# Altium project 2019主控板v1.2.PrjPcb
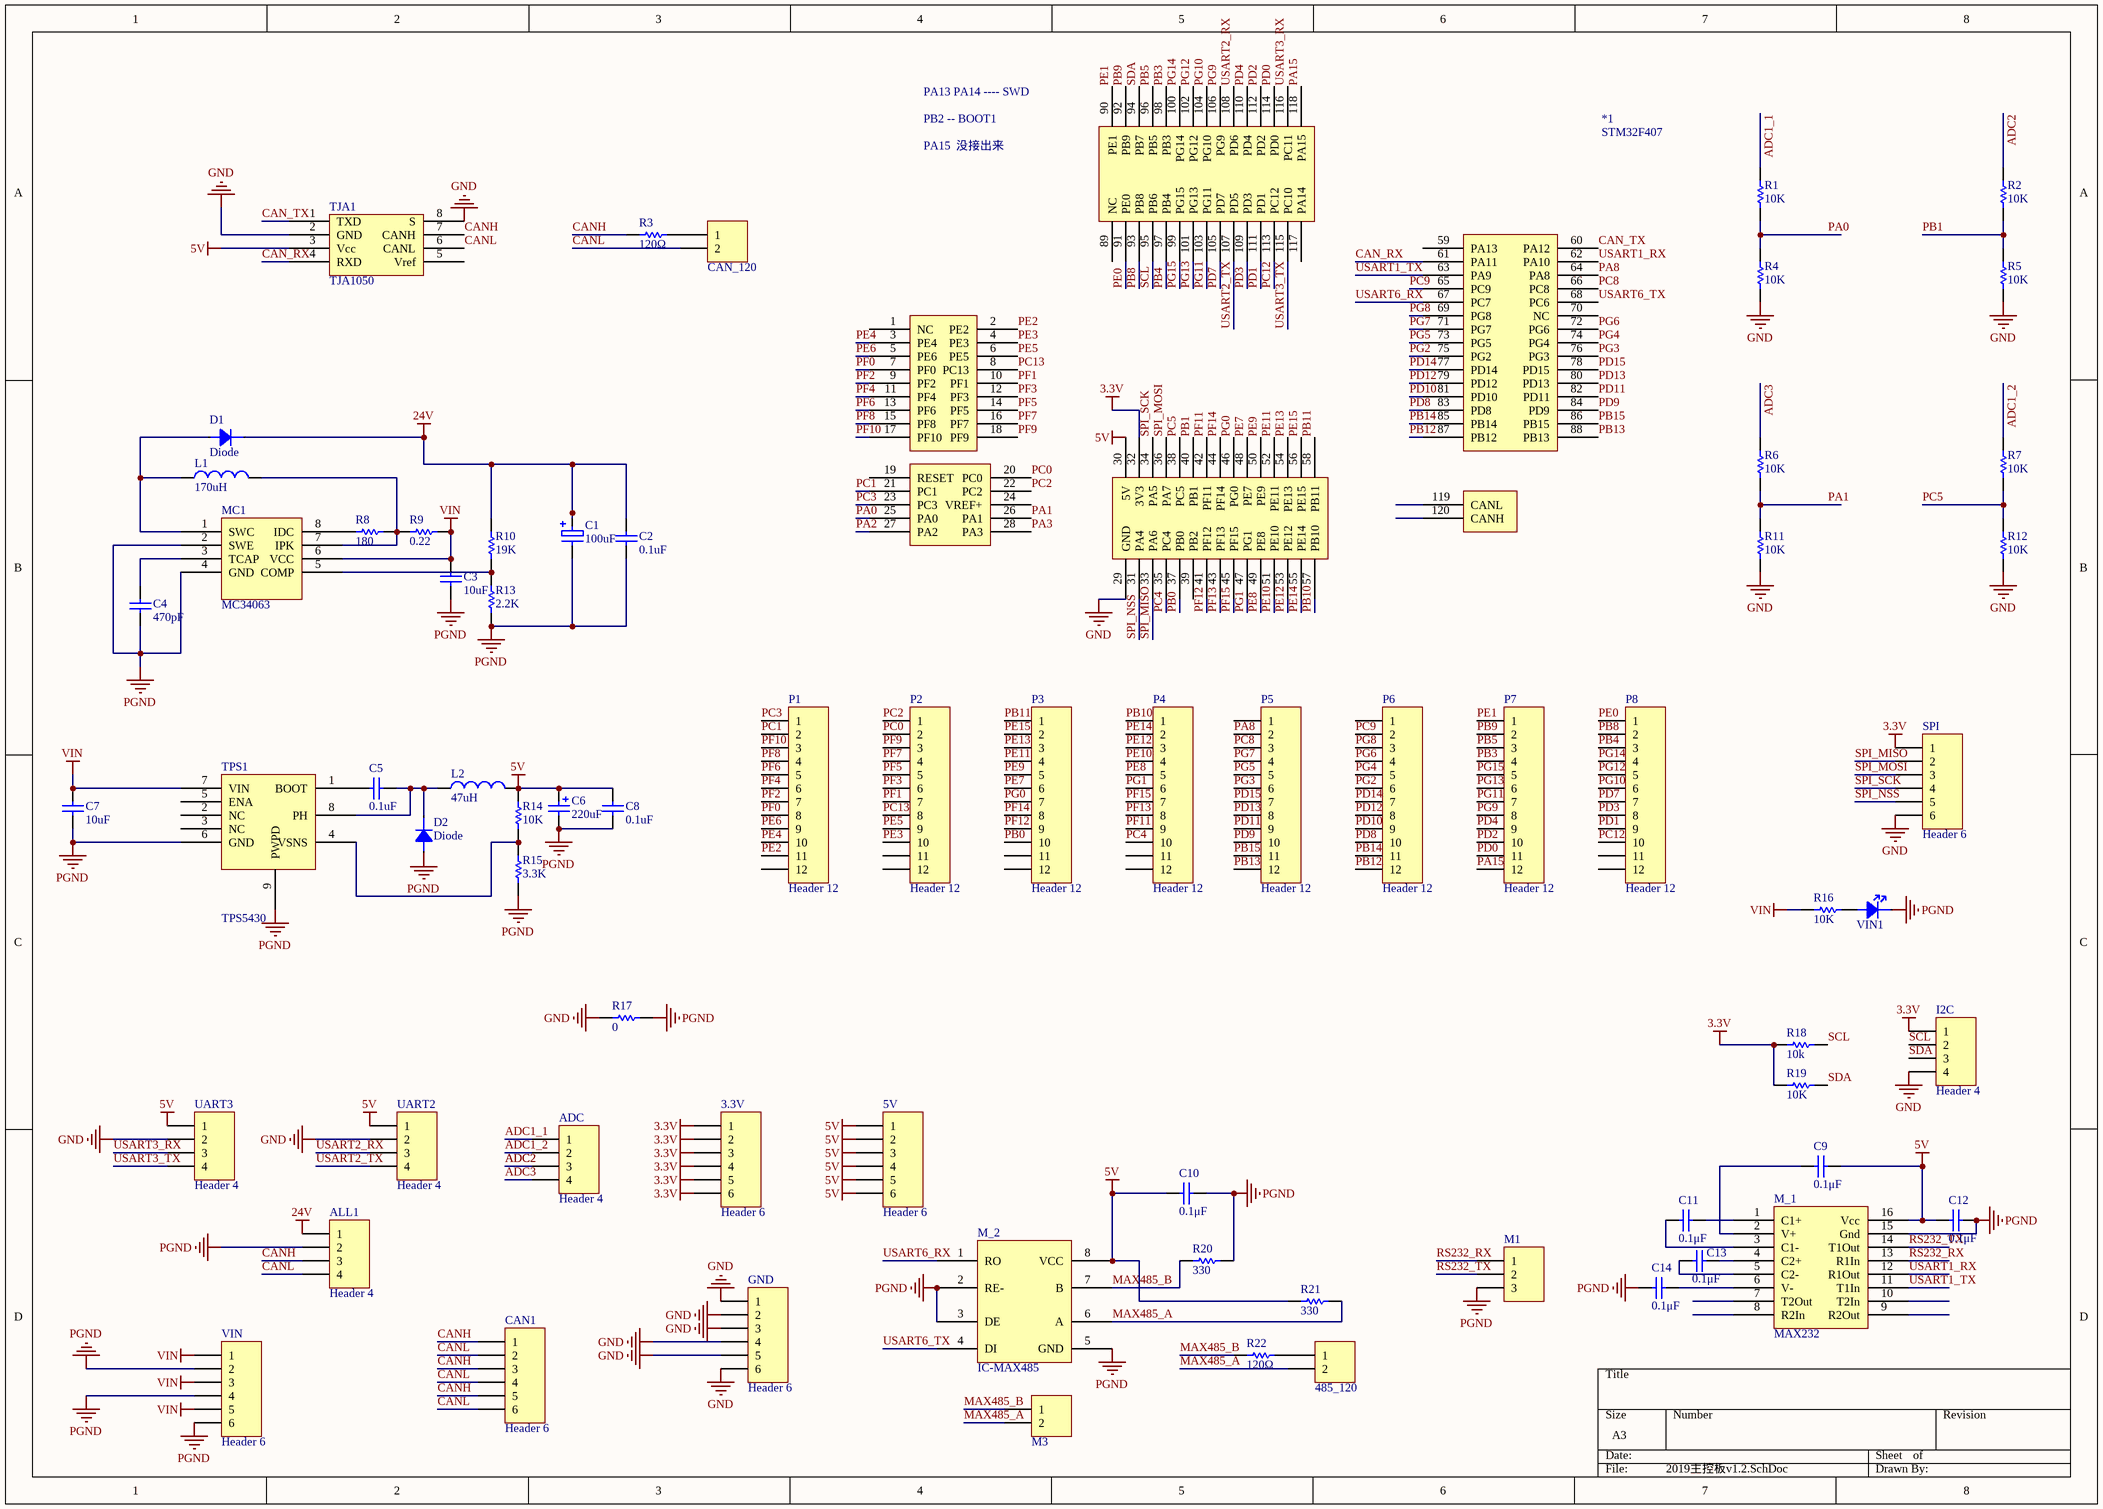
[diagram p0: 2019主控板v1.2.SchDoc]
1 sheet, 70 parts. Net scope: global (net labels, ports and power ports of the same name join across sheets).
Board file: 2019主控板v1.2.PcbDoc

## Sheet 2019主控板v1.2.SchDoc
size A3

### Parts
3.3V  Header 6  [XH-2.54PIN6]
5V  Header 6  [XH-2.54PIN6]
485_120  Header 2  [SIP2]  (value not drawn)
*1  STM32F407  [STM32F407]
ADC  Header 4  [XH-2.54pin4]
ALL1  Header 4  [XH-2.54pin4]
C1  100uF  [C_ELE]
C2  value 0.1uF  [CAP-MLCC-0603]  (hidden comment: Cap)
C3  value 10uF  [0805C]  (hidden comment: Cap)
C4  value 470pF  [CAP-MLCC-0603]  (hidden comment: Cap)
C5  value 0.1uF  [CAP-MLCC-0603]  (hidden comment: Cap)
C6  value 220uF  [CAP-TAN-7343/CAPD]  (hidden comment: Cap Pol1)
C7  value 10uF  [0805C]  (hidden comment: Cap)
C8  value 0.1uF  [CAP-MLCC-0603]  (hidden comment: Cap)
C9  0.1μF  [CAP-MLCC-0603]
C10  0.1μF  [CAP-MLCC-0603]
C11  0.1μF  [CAP-MLCC-0603]
C12  0.1μF  [CAP-MLCC-0603]
C13  0.1μF  [CAP-MLCC-0603]
C14  0.1μF  [CAP-MLCC-0603]
CAN1  Header 6  [Green_6P]
CAN_120  Header 2  [SIP2]  (value not drawn)
D1  Diode  [SS34]
D2  Diode  [SS34]
GND  Header 6  [XH-2.54PIN6]
I2C  Header 4  [XH-2.54pin4]
L1  value 170uH  [CD74]  (hidden comment: Inductor)
L2  value 47uH  [CD74]  (hidden comment: Inductor)
M1  Header 3  [Green_3P]  (value not drawn)
M3  Header 2  [Green_2P]  (value not drawn)
M_1  MAX232  [SO-16_M]
M_2  IC-MAX485  [SO8_M]
MC1  MC34063  [SO8]
P1  Header 12  [XH-2.54PIN12]
P2  Header 12  [XH-2.54PIN12]
P3  Header 12  [XH-2.54PIN12]
P4  Header 12  [XH-2.54PIN12]
P5  Header 12  [XH-2.54PIN12]
P6  Header 12  [XH-2.54PIN12]
P7  Header 12  [XH-2.54PIN12]
P8  Header 12  [XH-2.54PIN12]
R1  value 10K  [RES-0603]  (hidden comment: Res1)
R2  value 10K  [RES-0603]  (hidden comment: Res1)
R3  120Ω  [RES-0603]
R4  value 10K  [RES-0603]  (hidden comment: Res1)
R5  value 10K  [RES-0603]  (hidden comment: Res1)
R6  value 10K  [RES-0603]  (hidden comment: Res1)
R7  value 10K  [RES-0603]  (hidden comment: Res1)
R8  value 180  [RES-0603]  (hidden comment: Res1)
R9  value 0.22  [RES-0603]  (hidden comment: Res1)
R10  value 19K  [RES-0603]  (hidden comment: Res1)
R11  value 10K  [RES-0603]  (hidden comment: Res1)
R12  value 10K  [RES-0603]  (hidden comment: Res1)
R13  value 2.2K  [RES-0603]  (hidden comment: Res1)
R14  value 10K  [RES-0603]  (hidden comment: Res1)
R15  value 3.3K  [RES-0603]  (hidden comment: Res1)
R16  value 10K  [RES-0603]  (hidden comment: Res1)
R17  value 0  [RES-0603]  (hidden comment: Res1)
R18  10k  [RES-0603]
R19  10K  [RES-0603]
R20  330  [RES-0603]
R21  330  [RES-0603]
R22  120Ω  [RES-0603]
SPI  Header 6  [XH-2.54PIN6]
TJA1  TJA1050  [TJA1050]
TPS1  TPS5430  [TPS5430]
UART2  Header 4  [HDR1X4]
UART3  Header 4  [HDR1X4]
VIN  Header 6  [Green_6P]
VIN1  lED  [0805D]  (value not drawn)

### Nets
3.3V: 3.3V.1 3.3V.2 3.3V.3 3.3V.4 3.3V.5 3.3V.6 *1.32(3V3) I2C.1 R18.1 R19.1 SPI.1
5V: 5V.1 5V.2 5V.3 5V.4 5V.5 5V.6 *1.30(5V) C6.1 C8.2 C9.2 C10.1 C12.1 L2.2 M_1.16(Vcc) M_2.8(VCC) R14.2 R21.2 TJA1.3(Vcc) UART2.1 UART3.1
24V: ALL1.1 C1.1 C2.2 D1.K R10.1
GND: *1.29(GND) GND.1 GND.2 GND.3 GND.4 GND.5 GND.6 I2C.4 R4.1 R5.1 R11.1 R12.1 R17.2 SPI.6 TJA1.2(GND) TJA1.8(S) UART2.2 UART3.2
PGND: ALL1.2 C1.2 C2.1 C3.1 C4.1 C6.2 C7.1 C8.1 C10.2 C12.2 C14.1 D2.A M1.3 M_1.15(Gnd) M_2.2(RE-) M_2.3(DE) M_2.5(GND) MC1.2(SWE) MC1.4(GND) R13.2 R15.1 R17.1 R20.1 TPS1.6(GND) TPS1.9(PWPD) VIN.2 VIN.4 VIN.6 VIN1.K
VIN: C3.2 C7.2 MC1.6(VCC) R9.1 R16.2 TPS1.7(VIN) VIN.1 VIN.3 VIN.5
ADC1_1: ADC.1 R1.2
ADC1_2: ADC.2 R7.2
ADC2: ADC.3 R2.2
ADC3: ADC.4 R6.2
CAN_RX: *1.61(PA11) TJA1.4(RXD)
CAN_TX: *1.60(PA12) TJA1.1(TXD)
CANH: ALL1.3 CAN1.1 CAN1.3 CAN1.5 R3.2 TJA1.7(CANH)
CANL: ALL1.4 CAN1.2 CAN1.4 CAN1.6 CAN_120.2 TJA1.6(CANL)
MAX485_A: 485_120.2 M3.2 M_2.6(A) R21.1
MAX485_B: M3.1 M_2.7(B) R20.2 R22.2
PA0: *1.25(PA0) R1.1 R4.2
PA1: *1.26(PA1) R6.1 R11.2
PA2: *1.27(PA2)
PA3: *1.28(PA3)
PA8: *1.64(PA8) P5.2
PA15: *1.118(PA15) P7.12
PB0: *1.37(PB0) P3.10
PB1: *1.40(PB1) R2.1 R5.2
PB3: *1.98(PB3) P7.4
PB4: *1.97(PB4) P8.3
PB5: *1.96(PB5) P7.3
PB8: *1.93(PB8) P8.2
PB9: *1.92(PB9) P7.2
PB10: *1.57(PB10) P4.1
PB11: *1.58(PB11) P3.1
PB12: *1.87(PB12) P6.12
PB13: *1.88(PB13) P5.12
PB14: *1.85(PB14) P6.11
PB15: *1.86(PB15) P5.11
PC0: *1.20(PC0) P2.2
PC1: *1.21(PC1) P1.2
PC2: *1.22(PC2) P2.1
PC3: *1.23(PC3) P1.1
PC4: *1.35(PC4) P4.10
PC5: *1.38(PC5) R7.1 R12.2
PC8: *1.66(PC8) P5.3
PC9: *1.65(PC9) P6.2
PC12: *1.113(PC12) P8.10
PC13: *1.8(PC13) P2.8
PD0: *1.114(PD0) P7.11
PD1: *1.111(PD1) P8.9
PD2: *1.112(PD2) P7.10
PD3: *1.109(PD3) P8.8
PD4: *1.110(PD4) P7.9
PD7: *1.105(PD7) P8.7
PD8: *1.83(PD8) P6.10
PD9: *1.84(PD9) P5.10
PD10: *1.81(PD10) P6.9
PD11: *1.82(PD11) P5.9
PD12: *1.79(PD12) P6.8
PD13: *1.80(PD13) P5.8
PD14: *1.77(PD14) P6.7
PD15: *1.78(PD15) P5.7
PE0: *1.91(PE0) P8.1
PE1: *1.90(PE1) P7.1
PE2: *1.2(PE2) P1.11
PE3: *1.4(PE3) P2.10
PE4: *1.3(PE4) P1.10
PE5: *1.6(PE5) P2.9
PE6: *1.5(PE6) P1.9
PE7: *1.48(PE7) P3.6
PE8: *1.49(PE8) P4.5
PE9: *1.50(PE9) P3.5
PE10: *1.51(PE10) P4.4
PE11: *1.52(PE11) P3.4
PE12: *1.53(PE12) P4.3
PE13: *1.54(PE13) P3.3
PE14: *1.55(PE14) P4.2
PE15: *1.56(PE15) P3.2
PF0: *1.7(PF0) P1.8
PF1: *1.10(PF1) P2.7
PF2: *1.9(PF2) P1.7
PF3: *1.12(PF3) P2.6
PF4: *1.11(PF4) P1.6
PF5: *1.14(PF5) P2.5
PF6: *1.13(PF6) P1.5
PF7: *1.16(PF7) P2.4
PF8: *1.15(PF8) P1.4
PF9: *1.18(PF9) P2.3
PF10: *1.17(PF10) P1.3
PF11: *1.42(PF11) P4.9
PF12: *1.41(PF12) P3.9
PF13: *1.43(PF13) P4.8
PF14: *1.44(PF14) P3.8
PF15: *1.45(PF15) P4.7
PG0: *1.46(PG0) P3.7
PG1: *1.47(PG1) P4.6
PG2: *1.75(PG2) P6.6
PG3: *1.76(PG3) P5.6
PG4: *1.74(PG4) P6.5
PG5: *1.73(PG5) P5.5
PG6: *1.72(PG6) P6.4
PG7: *1.71(PG7) P5.4
PG8: *1.69(PG8) P6.3
PG9: *1.106(PG9) P7.8
PG10: *1.104(PG10) P8.6
PG11: *1.103(PG11) P7.7
PG12: *1.102(PG12) P8.5
PG13: *1.101(PG13) P7.6
PG14: *1.100(PG14) P8.4
PG15: *1.99(PG15) P7.5
RS232_RX: M1.1 M_1.13(R1In)
RS232_TX: M1.2 M_1.14(T1Out)
SCL: *1.95(PB6) I2C.2 R18.2
SDA: *1.94(PB7) I2C.3 R19.2
SPI_MISO: *1.33(PA6) SPI.2
SPI_MOSI: *1.36(PA7) SPI.3
SPI_NSS: *1.31(PA4) SPI.5
SPI_SCK: *1.34(PA5) SPI.4
USART1_RX: *1.62(PA10) M_1.12(R1Out)
USART1_TX: *1.63(PA9) M_1.11(T1In)
USART2_RX: *1.108(PD6) UART2.3
USART2_TX: *1.107(PD5) UART2.4
USART3_RX: *1.116(PC11) UART3.3
USART3_TX: *1.115(PC10) UART3.4
USART6_RX: *1.67(PC7) M_2.1(RO)
USART6_TX: *1.68(PC6) M_2.4(DI)
Net485_120_1: 485_120.1 R22.1
NetC4_2: C4.2 MC1.3(TCAP)
NetC5_1: C5.1 TPS1.1(BOOT)
NetC5_2: C5.2 D2.K L2.1 TPS1.8(PH)
NetC9_1: C9.1 M_1.2(V+)
NetC11_1: C11.1 M_1.3(C1-)
NetC11_2: C11.2 M_1.1(C1+)
NetC13_1: C13.1 M_1.5(C2-)
NetC13_2: C13.2 M_1.4(C2+)
NetC14_2: C14.2 M_1.6(V-)
NetCAN_120_1: CAN_120.1 R3.1
NetD1_A: D1.A L1.1 MC1.1(SWC)
NetL1_2: L1.2 MC1.7(IPK) R8.1 R9.2
NetMC1_5: MC1.5(COMP) R10.2 R13.1
NetMC1_8: MC1.8(IDC) R8.2
NetR14_1: R14.1 R15.2 TPS1.4(VSNS)
NetR16_1: R16.1 VIN1.A

Not connected (* = marked no-connect by the designer): *1 1(NC) 19(RESET) 24(VREF+) 39(PB2) 59(PA13) 70(NC) 89(NC) 117(PA14) 119(CANL) 120(CANH); M_1 7(T2Out) 8(R2In) 9(R2Out) 10(T2In); P1 12; P2 11 12; P3 11 12; P4 11 12; P5 1; P6 1; P8 11 12; TJA1 5(Vref); TPS1 2(NC) 3(NC) 5(ENA)

### Notes on the sheet
- (near *1) PA13 PA14 ---- SWD
- (near *1) PB2 -- BOOT1
- (near *1) PA15  没接出来

### Library data of the parts
3.3V 5V CAN1 GND SPI VIN = Header 6: Header, 6-Pin; LatestRevisionDate: 17-Jul-2002; LatestRevisionNote: Re-released for DXP Platform.; Publisher: Altium Limited
485_120 CAN_120 M3 = Header 2: Header, 2-Pin; LatestRevisionDate: 17-Jul-2002; LatestRevisionNote: Re-released for DXP Platform.; Publisher: Altium Limited
ADC ALL1 I2C UART2 UART3 = Header 4: Header, 4-Pin; LatestRevisionDate: 17-Jul-2002; LatestRevisionNote: Re-released for DXP Platform.; Publisher: Altium Limited
C1 = CAP-ELE: 电解电容; Value: *μF; Published: 8-Jun-2000; LatestRevisionDate: 17-Jul-2002; LatestRevisionNote: Re-released for DXP Platform.; PackageReference: RB7.6-15; Publisher: Altium Limited; PackageDescription: Polarized Capacitor (Radial); 2 Leads
C2-C5 C7 C8 = Cap: Capacitor; Published: 8-Jun-2000; LatestRevisionDate: 17-Jul-2002; LatestRevisionNote: Re-released for DXP Platform.; PackageReference: RAD-0.3; Publisher: Altium Limited
C6 = Cap Pol1: Polarized Capacitor (Radial); Published: 8-Jun-2000; LatestRevisionDate: 17-Jul-2002; LatestRevisionNote: Re-released for DXP Platform.; PackageReference: RB7.6-15; Publisher: Altium Limited
C9-C14 = CAP: 无极性电容; Value: *μF; Published: 8-Jun-2000; LatestRevisionDate: 17-Jul-2002; LatestRevisionNote: Re-released for DXP Platform.; PackageReference: RAD-0.3; Publisher: Altium Limited; PackageDescription: Radial Cap, Thru-Hole; 2 Leads; 0.3 in Pin Spacing
L1 L2 = Inductor: Code_IEC: 1005; Published: 8-Jun-2000; LatestRevisionDate: 17-Jul-2002; LatestRevisionNote: Re-released for DXP Platform.; PackageReference: 0402-A; Publisher: Altium Limited; Code_JEITA: 0402
M1 = Header 3: Header, 3-Pin; LatestRevisionDate: 17-Jul-2002; LatestRevisionNote: Re-released for DXP Platform.; Publisher: Altium Limited
M_1 = IC-MAX232
M_2 = IC-MAX485: MAX485
P1-P8 = Header 12: Header, 12-Pin; LatestRevisionDate: 17-Jul-2002; LatestRevisionNote: Re-released for DXP Platform.; Publisher: Altium Limited
R1 R2 R4-R17 = Res1: Resistor; Published: 8-Jun-2000; LatestRevisionDate: 17-Jul-2002; LatestRevisionNote: Re-released for DXP Platform.; PackageReference: AXIAL-0.3; Publisher: Altium Limited
R3 R18-R22 = RES: 电阻; Value: *kΩ; Published: 8-Jun-2000; LatestRevisionDate: 17-Jul-2002; LatestRevisionNote: Re-released for DXP Platform.; PackageReference: AXIAL-0.3; Publisher: Altium Limited; PackageDescription: Axial Device, Thru-Hole; 2 Leads; 0.3 in Pin Spacing
TJA1 = TJA1050: CAN总线收发器
VIN1 = 00-D-LED